# Altium project caja conexion.PrjPcb
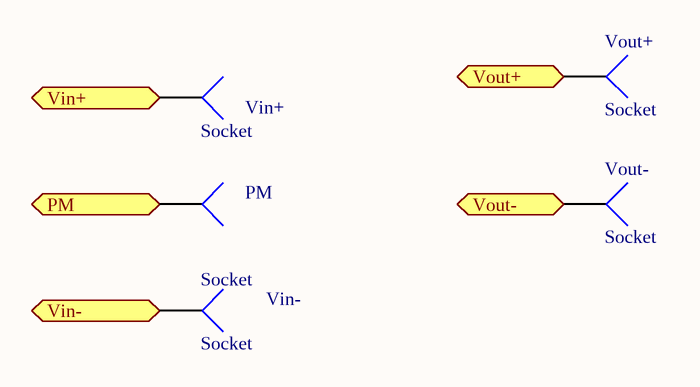
[diagram p0: trafo.SchDoc]
1 sheet, 5 parts. Net scope: flat (ports and power ports of the same name join across sheets).
Board file: caja conexion.PcbDoc

## Sheet trafo.SchDoc
size A4

### Parts
PM  Socket  [PIN1]
Vin+  Socket  [PIN1]
Vin-  Socket  [PIN1]
Vout+  Socket  [PIN1]
Vout-  Socket  [PIN1]

### Ports
PM (in), Vin+ (in), Vin- (in), Vout+ (out), Vout- (out)

### Nets
NetPM_1: PM.1 ; port PM
NetVin+_1: Vin+.1 ; port Vin+
NetVin-_1: Vin-.1 ; port Vin-
NetVout+_1: Vout+.1 ; port Vout+
NetVout-_1: Vout-.1 ; port Vout-

### Library data of the parts
PM Vin+ Vin- Vout+ Vout- = Socket: LatestRevisionDate: 17-Jul-2002; LatestRevisionNote: Re-released for DXP Platform.; Publisher: Altium Limited